# Altium project Triumvi_v10_mcu.PrjPcb
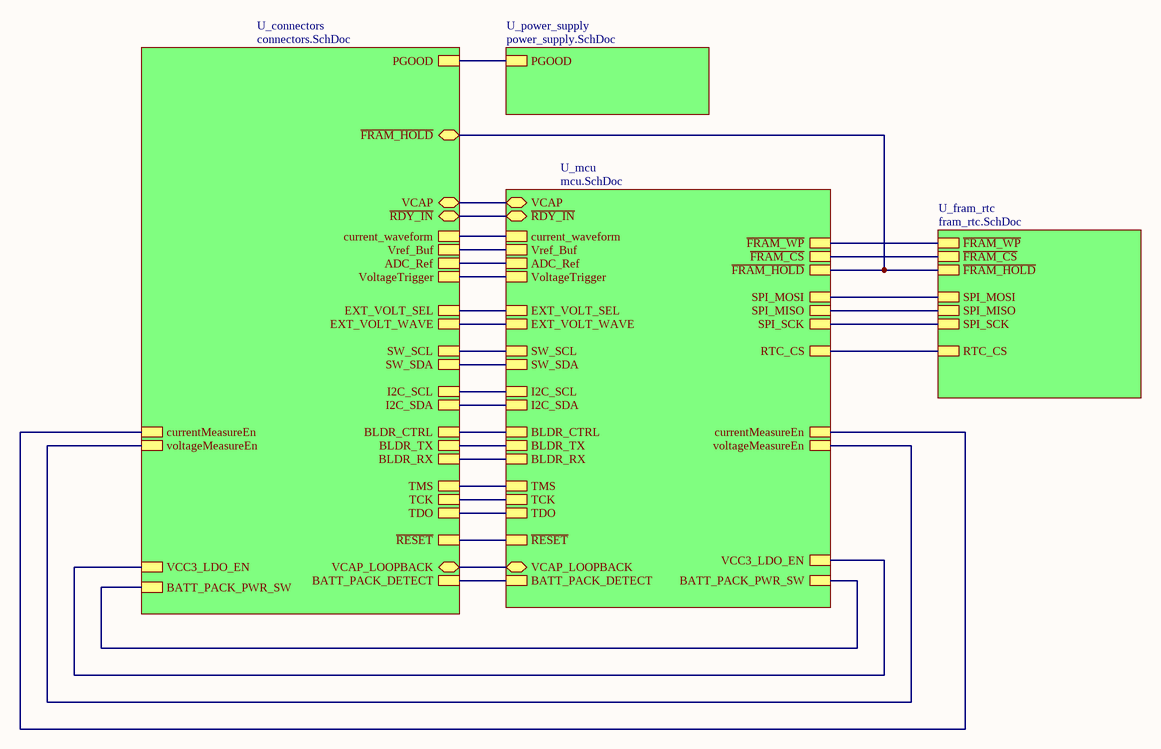
[diagram p0: top.SchDoc]
5 sheets, 66 parts. Net scope: hierarchical (ports join the sheet entries above them; power ports are global).
Board files: triumvi_v10_mcu.PcbDoc, triumvi_v10_mcu_panel.PcbDoc
Sheets:
  top.SchDoc
    U_connectors = connectors.SchDoc
    U_fram_rtc = fram_rtc.SchDoc
    U_mcu = mcu.SchDoc
    U_power_supply = power_supply.SchDoc

## Sheet top.SchDoc: Triumvi - MCU - Top
size Letter; Author: Ye-Sheng Kuo; Organization: Altium Limited; Address1: L3, 12a Rodborough Rd; Address2: Frenchs Forest; Address3: NSW; Address4: Australia 2086; Revision: 10; SheetNumber: 1; SheetTotal: 5

### Sub-sheets
U_connectors = connectors.SchDoc: I2C_SCL, I2C_SDA, EXT_VOLT_SEL, ~{RESET}, TMS, TCK, TDO, BLDR_CTRL, BLDR_TX, BLDR_RX, SW_SCL, SW_SDA, current_waveform, Vref_Buf, VoltageTrigger, VCC3_LDO_EN, voltageMeasureEn, currentMeasureEn, ADC_Ref, EXT_VOLT_WAVE, PGOOD, BATT_PACK_DETECT, BATT_PACK_PWR_SW, VCAP_LOOPBACK, VCAP, ~{RDY_IN}, ~{FRAM_HOLD}
U_fram_rtc = fram_rtc.SchDoc: ~{FRAM_WP}, ~{FRAM_CS}, ~{FRAM_HOLD}, SPI_MOSI, SPI_SCK, SPI_MISO, RTC_CS
U_mcu = mcu.SchDoc: current_waveform, Vref_Buf, voltageMeasureEn, currentMeasureEn, VoltageTrigger, ~{FRAM_WP}, ~{FRAM_CS}, ~{FRAM_HOLD}, SPI_SCK, SPI_MOSI, SPI_MISO, RTC_CS, I2C_SCL, I2C_SDA, EXT_VOLT_SEL, EXT_VOLT_WAVE, TDO, BLDR_CTRL, BLDR_TX, BLDR_RX, ~{RESET}, TMS, TCK, VCC3_LDO_EN, ADC_Ref, SW_SCL, SW_SDA, BATT_PACK_DETECT, BATT_PACK_PWR_SW, VCAP_LOOPBACK, VCAP, ~{RDY_IN}
U_power_supply = power_supply.SchDoc: PGOOD

### Nets
BATT_PACK_DETECT: sheet U_connectors/BATT_PACK_DETECT, sheet U_mcu/BATT_PACK_DETECT
BLD_CTRL: sheet U_connectors/BLDR_CTRL, sheet U_mcu/BLDR_CTRL
BLD_RX: sheet U_connectors/BLDR_RX, sheet U_mcu/BLDR_RX
BLD_TX: sheet U_connectors/BLDR_TX, sheet U_mcu/BLDR_TX
current_waveform: sheet U_connectors/current_waveform, sheet U_mcu/current_waveform
EXT_VOLT_SEL: sheet U_connectors/EXT_VOLT_SEL, sheet U_mcu/EXT_VOLT_SEL
EXT_VOLT_WAVE: sheet U_connectors/EXT_VOLT_WAVE, sheet U_mcu/EXT_VOLT_WAVE
I2C_SCL: sheet U_connectors/I2C_SCL, sheet U_mcu/I2C_SCL
I2C_SDA: sheet U_connectors/I2C_SDA, sheet U_mcu/I2C_SDA
PGOOD: sheet U_connectors/PGOOD, sheet U_power_supply/PGOOD
~{RDY_IN}: sheet U_connectors/~{RDY_IN}, sheet U_mcu/~{RDY_IN}
~{RESET}: sheet U_connectors/~{RESET}, sheet U_mcu/~{RESET}
SPI_CLK: sheet U_fram_rtc/SPI_SCK, sheet U_mcu/SPI_SCK
SPI_MISO: sheet U_fram_rtc/SPI_MISO, sheet U_mcu/SPI_MISO
SPI_MOSI: sheet U_fram_rtc/SPI_MOSI, sheet U_mcu/SPI_MOSI
TCK: sheet U_connectors/TCK, sheet U_mcu/TCK
TDO: sheet U_connectors/TDO, sheet U_mcu/TDO
TMS: sheet U_connectors/TMS, sheet U_mcu/TMS
VCAP: sheet U_connectors/VCAP, sheet U_mcu/VCAP
VCAP_LOOPBACK: sheet U_connectors/VCAP_LOOPBACK, sheet U_mcu/VCAP_LOOPBACK
Vref_Buf: sheet U_connectors/Vref_Buf, sheet U_mcu/Vref_Buf
NetJ1_2: sheet U_connectors/VoltageTrigger, sheet U_mcu/VoltageTrigger
NetJ1_3: sheet U_connectors/SW_SDA, sheet U_mcu/SW_SDA
NetJ1_4: sheet U_connectors/SW_SCL, sheet U_mcu/SW_SCL
NetJ1_8: sheet U_connectors/~{FRAM_HOLD}, sheet U_fram_rtc/~{FRAM_HOLD}, sheet U_mcu/~{FRAM_HOLD}
NetJ1_10: sheet U_connectors/VCC3_LDO_EN, sheet U_mcu/VCC3_LDO_EN
NetJ2_8: sheet U_connectors/voltageMeasureEn, sheet U_mcu/voltageMeasureEn
NetJ2_9: sheet U_connectors/currentMeasureEn, sheet U_mcu/currentMeasureEn
NetJ2_11: sheet U_connectors/ADC_Ref, sheet U_mcu/ADC_Ref
NetQ2_5: sheet U_connectors/BATT_PACK_PWR_SW, sheet U_mcu/BATT_PACK_PWR_SW
NetU1_1: sheet U_fram_rtc/~{FRAM_CS}, sheet U_mcu/~{FRAM_CS}
NetU1_3: sheet U_fram_rtc/~{FRAM_WP}, sheet U_mcu/~{FRAM_WP}
NetU2_30: sheet U_fram_rtc/RTC_CS, sheet U_mcu/RTC_CS

### Notes on the sheet
- Title
- Date:
- Author:
- Revision:
- Sheet
- of
- University of Michigan
- File:

## Sheet connectors.SchDoc: Triumvi - MCU - Connectors
size Letter; Author: Ye-Sheng Kuo; Revision: 10; SheetNumber: 5; SheetTotal: 5
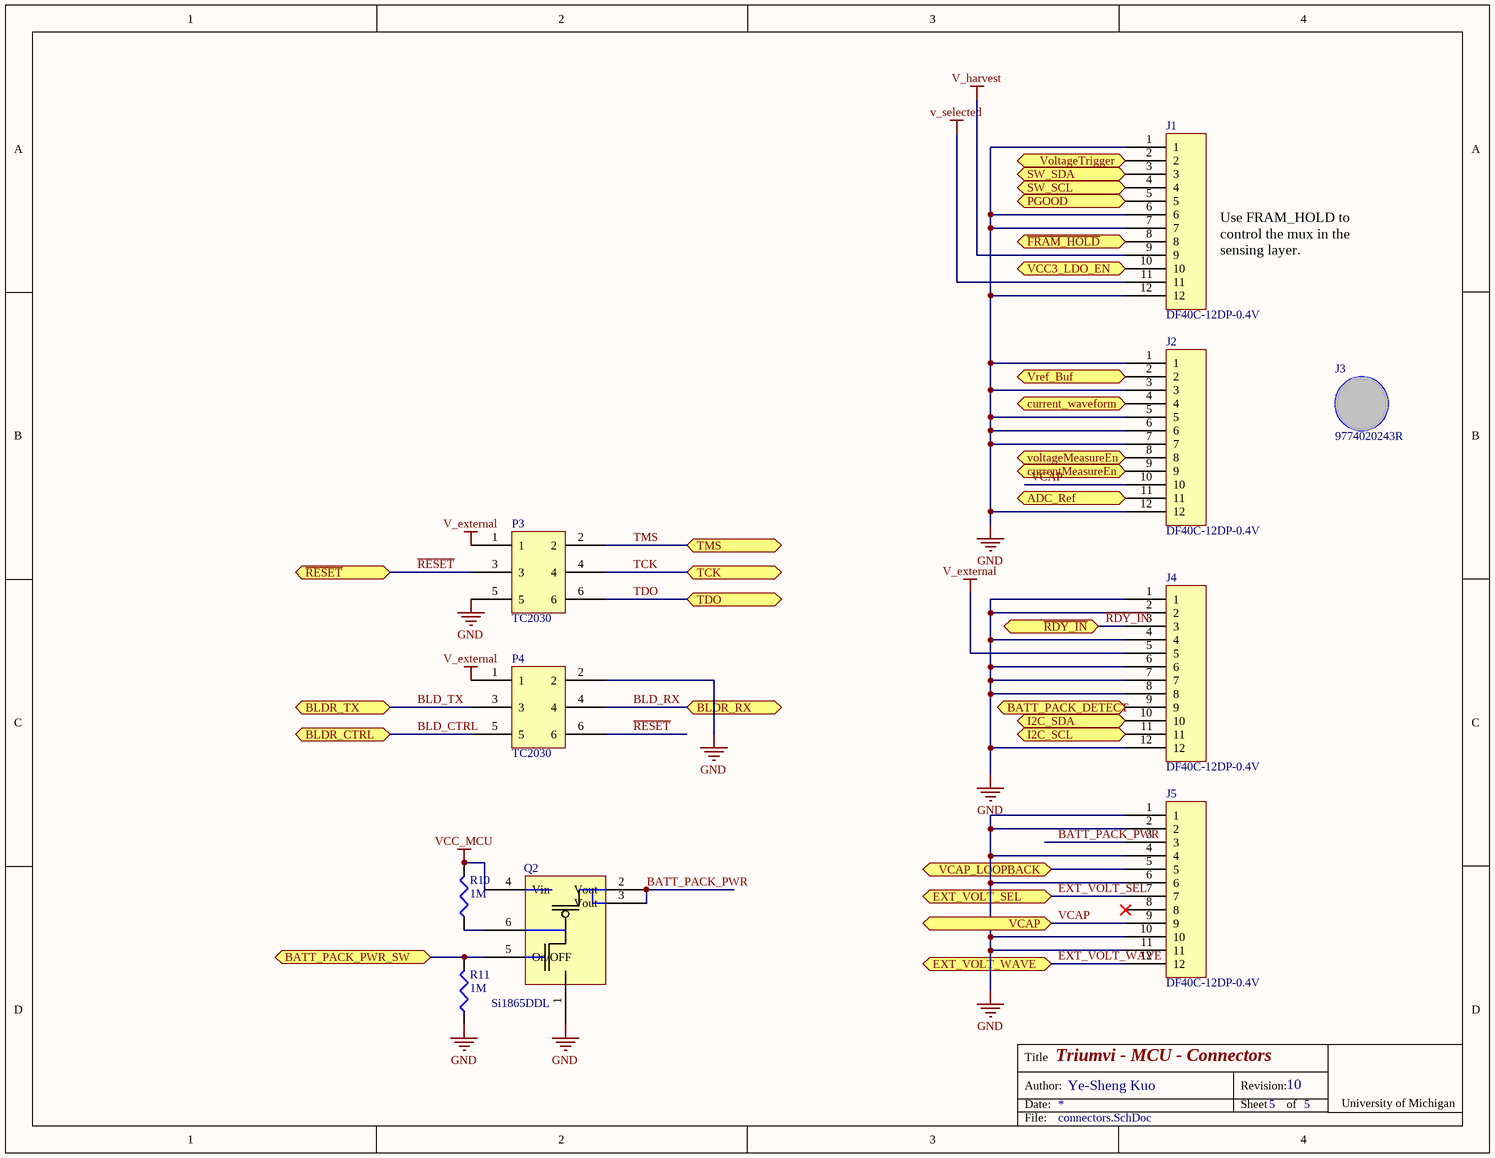
[diagram p1: connectors.SchDoc]

### Parts
J1  DF40C-12DP-0.4V  [DF40C-12DP-0.4V]
J2  DF40C-12DP-0.4V  [DF40C-12DP-0.4V]
J3  9774020243R  [9774020243R]
J4  DF40C-12DP-0.4V  [DF40C-12DP-0.4V]
J5  DF40C-12DP-0.4V  [DF40C-12DP-0.4V]
P3  TC2030  [TC2030-IDC-NLFP]
P4  TC2030  [TC2030-IDC-NLFP]
Q2  Si1865DDL  [SC70-6]
R10  value 1M  [0402]  (hidden comment: Chip resistor)
R11  value 1M  [0402]  (hidden comment: Chip resistor)

### Ports
ADC_Ref, BATT_PACK_DETECT, BATT_PACK_PWR_SW, BLDR_CTRL, BLDR_RX, BLDR_TX, current_waveform, currentMeasureEn, EXT_VOLT_SEL, EXT_VOLT_WAVE, I2C_SCL, I2C_SDA, PGOOD, SW_SCL, SW_SDA, TCK, TDO, TMS, VCAP, VCAP_LOOPBACK, VCC3_LDO_EN, voltageMeasureEn, VoltageTrigger, Vref_Buf, ~{FRAM_HOLD}, ~{RDY_IN}, ~{RESET}

### Nets
GND: J1.1 J1.6 J1.7 J1.12 J2.1 J2.3 J2.5 J2.6 J2.7 J2.12 J4.1 J4.2 J4.4 J4.6 J4.7 J4.8 J4.12 J5.1 J5.2 J5.4 J5.6 J5.10 J5.11 P3.5 P4.2 Q2.1(S1) R11.2
V_external: J4.5 P3.1 P4.1
V_harvest: J1.9
v_selected: J1.11
VCC_MCU: Q2.4(Vin) R10.1
BATT_PACK_DETECT: J4.9 ; port BATT_PACK_DETECT
BATT_PACK_PWR: J5.3 Q2.2(Vout) Q2.3(Vout)
BLD_CTRL: P4.5 ; port BLDR_CTRL
BLD_RX: P4.4 ; port BLDR_RX
BLD_TX: P4.3 ; port BLDR_TX
current_waveform: J2.4 ; port current_waveform
EXT_VOLT_SEL: J5.7 ; port EXT_VOLT_SEL
EXT_VOLT_WAVE: J5.12 ; port EXT_VOLT_WAVE
I2C_SCL: J4.11 ; port I2C_SCL
I2C_SDA: J4.10 ; port I2C_SDA
PGOOD: J1.5 ; port PGOOD
~{RDY_IN}: J4.3 ; port ~{RDY_IN}
~{RESET}: P3.3 P4.6 ; port ~{RESET}
TCK: P3.4 ; port TCK
TDO: P3.6 ; port TDO
TMS: P3.2 ; port TMS
VCAP: J2.10 J5.9 ; port VCAP
VCAP_LOOPBACK: J5.5 ; port VCAP_LOOPBACK
Vref_Buf: J2.2 ; port Vref_Buf
NetJ1_2: J1.2 ; port VoltageTrigger
NetJ1_3: J1.3 ; port SW_SDA
NetJ1_4: J1.4 ; port SW_SCL
NetJ1_8: J1.8 ; port ~{FRAM_HOLD}
NetJ1_10: J1.10 ; port VCC3_LDO_EN
NetJ2_8: J2.8 ; port voltageMeasureEn
NetJ2_9: J2.9 ; port currentMeasureEn
NetJ2_11: J2.11 ; port ADC_Ref
NetQ2_5: Q2.5(On/OFF) R11.1 ; port BATT_PACK_PWR_SW
NetQ2_6: Q2.6(D1) R10.2

Not connected (* = marked no-connect by the designer): J5 8*

### Notes on the sheet
- Use FRAM_HOLD to control the mux in the sensing layer.
- Title
- Date:
- Author:
- Revision:
- Sheet
- of
- University of Michigan
- File:

### Library data of the parts
J1 J2 J4 J5 = DF40C-12DP-0.4V: Hirose BM20 Series, 0.4mm pitch, 12 pos, header; Supplier 1: Digi-Key; Supplier Part Number 1: H124599CT-ND
J3 = 9774020243R: 2 mm stack height, m2 standoff; Supplier 1: Digi-Key; Supplier Part Number 1: 732-7073-1-ND
P3 P4 = TC2030: TC2030-MCP-NL
Q2 = Si1865DDL: Load Switch with Level-Shift; Supplier 1: Digi-Key; Supplier Part Number 1: SI1865DDL-T1-GE3CT-ND
R10 R11 = R_1M_0402: Chip resistor, 1M, 0402 package; tolerance: 1%; power: 1/16 W; Supplier 1: Digi-Key; Supplier Part Number 1: 541-1.00MLCT-ND; package: 0402

## Sheet fram_rtc.SchDoc: Triumvi - MCU - FRAM, RTC
size Letter; Author: Ye-Sheng Kuo; Revision: 10; SheetNumber: 4; SheetTotal: 5
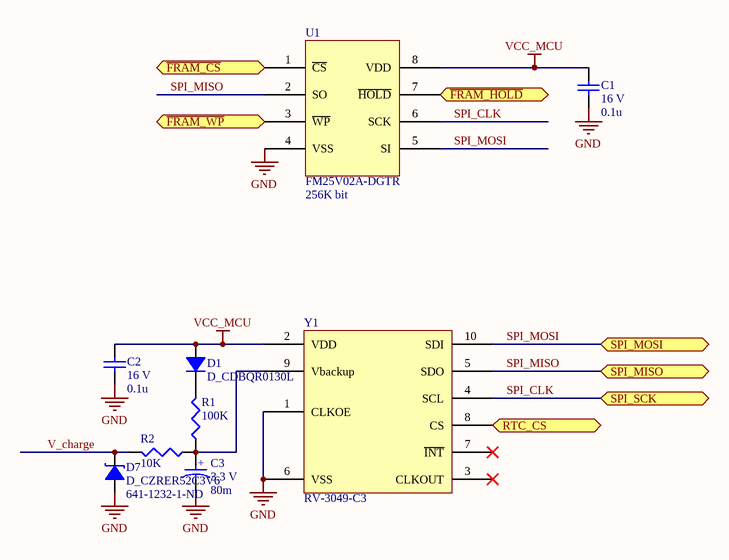
[diagram p2: fram_rtc.SchDoc]

### Parts
C1  value 0.1u  voltage rated: 16 V  [0402]  (hidden comment: Ceramic capacitor)
C2  value 0.1u  voltage rated: 16 V  [0402]  (hidden comment: Ceramic capacitor)
C3  value 80m  voltage rated: 3.3 V  [XH414HG-IV01E]  (hidden comment: Electric Double Layer Capacitors)
D1  D_CDBQR0130L  [0402 - DIODE]
D7  D_CZRER52C3V6  Supplier Part Number 1: 641-1232-1-ND  [0503/SOD-723F]
R1  value 100K  [0402]  (hidden comment: Chip resistor)
R2  value 10K  [0402]  (hidden comment: Chip resistor)
U1  FM25V02A-DGTR  Size: 256K bit  [TDFN-8]
Y1  RV-3049-C3  [RV-3049-C3]

### Ports
RTC_CS, SPI_MISO, SPI_MOSI, SPI_SCK, ~{FRAM_CS}, ~{FRAM_HOLD}, ~{FRAM_WP}

### Nets
GND: C1.2 C2.2 C3.2 D7.1 U1.4(VSS) Y1.1(CLKOE) Y1.6(VSS)
VCC_MCU: C1.1 C2.1 D1.1 U1.8(VDD) Y1.2(VDD)
SPI_CLK: U1.6(SCK) Y1.4(SCL) ; port SPI_SCK
SPI_MISO: U1.2(SO) Y1.5(SDO) ; port SPI_MISO
SPI_MOSI: U1.5(SI) Y1.10(SDI) ; port SPI_MOSI
V_charge: D7.2 R2.1
NetC3_1: C3.1 R1.2 R2.2 Y1.9(Vbackup)
NetD1_2: D1.2 R1.1
NetJ1_8: U1.7(~{HOLD}) ; port ~{FRAM_HOLD}
NetU1_1: U1.1(~{CS}) ; port ~{FRAM_CS}
NetU1_3: U1.3(~{WP}) ; port ~{FRAM_WP}
NetU2_30: Y1.8(CS) ; port RTC_CS

Not connected (* = marked no-connect by the designer): Y1 3(CLKOUT)* 7(~{INT})*

### Notes on the sheet
- Title
- Date:
- Author:
- Revision:
- Sheet
- of
- University of Michigan
- File:
- (in symbol C_80m_3.3V_supercap) +

### Library data of the parts
C1 C2 = C_0.1u_16V_0402_ceramic: Ceramic capacitor, 0.1u, 16 V, 0402 package; Manufacture: Murata; tolerance: 10%; Temperature Coef: X7R; package: 0402; Supplier 1: Digi-Key; Supplier Part Number 1: 490-3261-1-ND
C3 = C_80m_3.3V_supercap: Manufacture: Seiko Instruments; Supplier 1: Digi-Key; Supplier Part Number 1: 728-1050-1-ND
D1 = D_CDBQR0130L: SMD Schottky Barrier Diode; package: 0402; Supplier 1: Digi-Key; Supplier Part Number 1: 641-1271-1-ND
D7 = D_CZRER52C3V6: SURFACE MOUNT ZENER DIODE; package: 0603; Supplier 1: Digi-Key
R1 = R_100K_0402: Chip resistor, 100K, 0402 package; tolerance: 1%; power: 1/16 W; Supplier 1: Digi-Key; Supplier Part Number 1: 541-100KLCT-ND; package: 0402
R2 = R_10K_0402: Chip resistor, 10K, 0402 package; tolerance: 1%; power: 1/16 W; Supplier 1: Digi-Key; Supplier Part Number 1: 541-10.0KLCT-ND; package: 0402
U1 = FM25V02A-DGTR: 256-Kbit (32 K × 8) Serial (SPI) F-RAM; Manufacturer: Cypress Semiconductor; Manufactuere part number: FM25V02A-DGTR; Supplier 1: Digi-Key; Supplier Part Number 1: FM25V02A-DGTR-ND
Y1 = RV-3049-C3: Real Time Clock Module with SPI-Bus

## Sheet mcu.SchDoc: Triumvi - MCU - CC2538
size Letter; Author: Ye-Sheng Kuo; Revision: 10; SheetNumber: 2; SheetTotal: 5
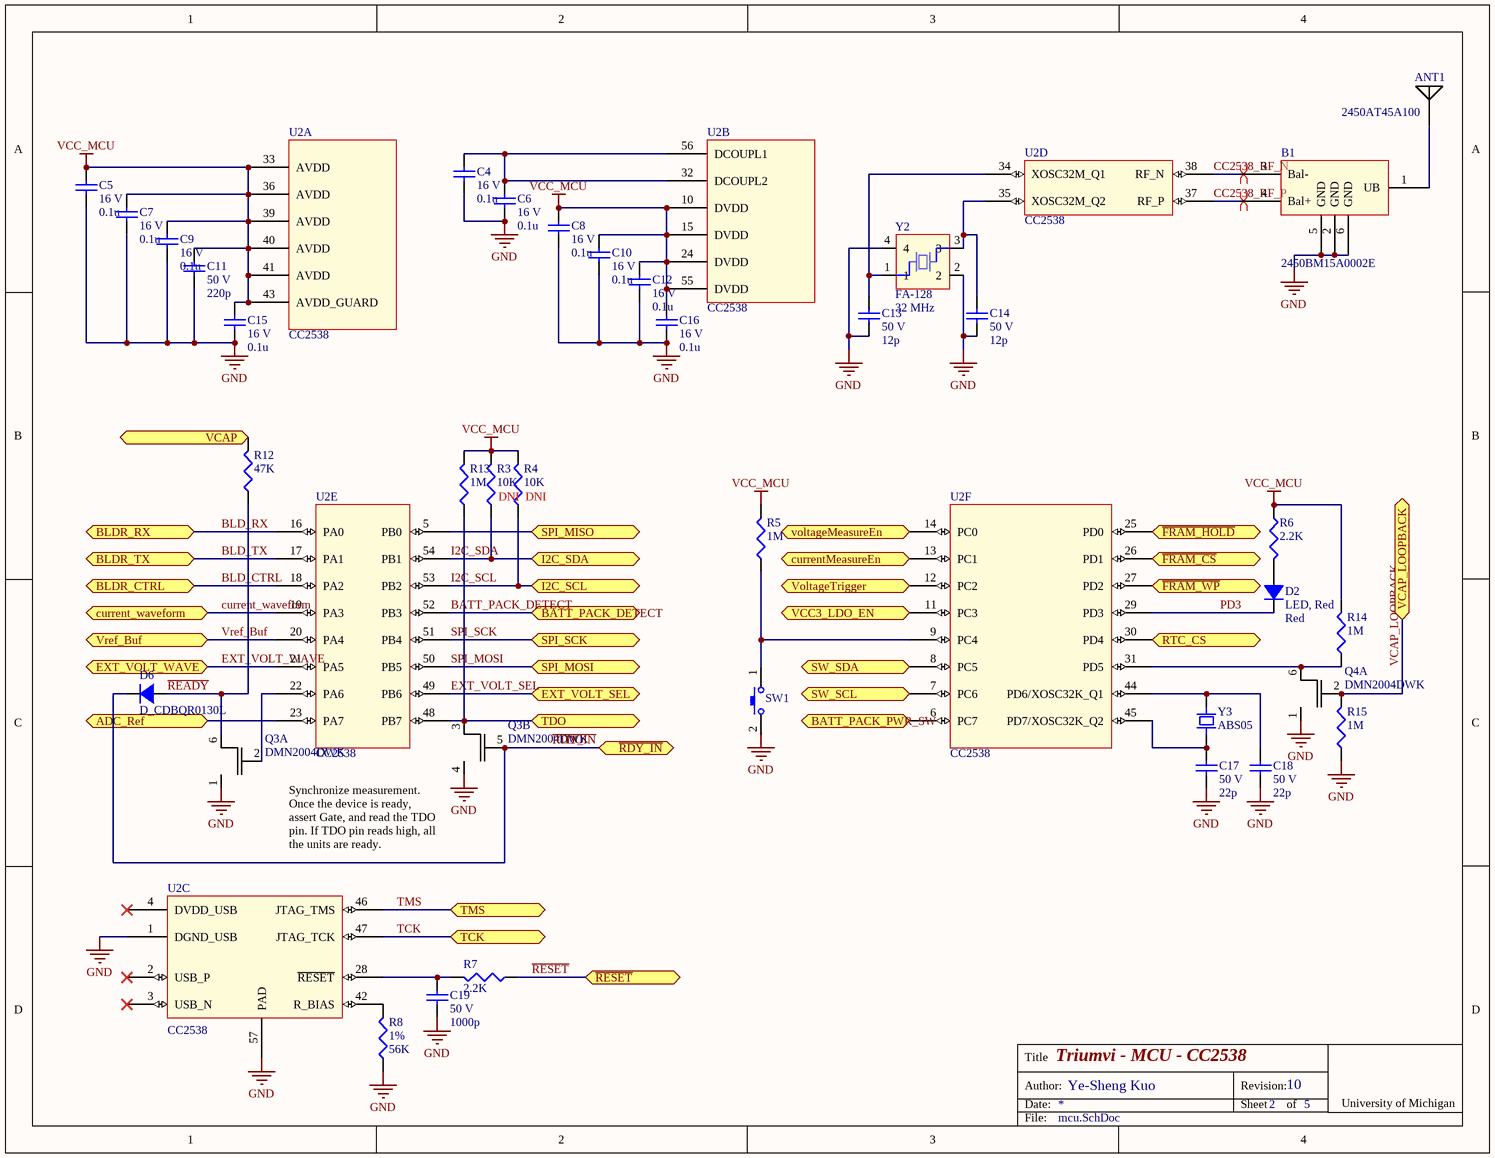
[diagram p3: mcu.SchDoc]

### Parts
ANT1  2450AT45A100  [2450AT45A100]
B1  2450BM15A0002E  [2450BM15A0002]
C4  value 0.1u  voltage rated: 16 V  [0402]  (hidden comment: Ceramic capacitor)
C5  value 0.1u  voltage rated: 16 V  [0402]  (hidden comment: Ceramic capacitor)
C6  value 0.1u  voltage rated: 16 V  [0402]  (hidden comment: Ceramic capacitor)
C7  value 0.1u  voltage rated: 16 V  [0402]  (hidden comment: Ceramic capacitor)
C8  value 0.1u  voltage rated: 16 V  [0402]  (hidden comment: Ceramic capacitor)
C9  value 0.1u  voltage rated: 16 V  [0402]  (hidden comment: Ceramic capacitor)
C10  value 0.1u  voltage rated: 16 V  [0402]  (hidden comment: Ceramic capacitor)
C11  value 220p  voltage rated: 50 V  [0402]  (hidden comment: Ceramic capacitor)
C12  value 0.1u  voltage rated: 16 V  [0402]  (hidden comment: Ceramic capacitor)
C13  value 12p  voltage rated: 50 V  [0402]  (hidden comment: Ceramic capacitor)
C14  value 12p  voltage rated: 50 V  [0402]  (hidden comment: Ceramic capacitor)
C15  value 0.1u  voltage rated: 16 V  [0402]  (hidden comment: Ceramic capacitor)
C16  value 0.1u  voltage rated: 16 V  [0402]  (hidden comment: Ceramic capacitor)
C17  value 22p  voltage rated: 50 V  [0402]  (hidden comment: Ceramic capacitor)
C18  value 22p  voltage rated: 50 V  [0402]  (hidden comment: Ceramic capacitor)
C19  value 1000p  voltage rated: 50 V  [0402]  (hidden comment: Ceramic capacitor)
D2  LED, Red  Color: Red  [0402 - DIODE]
D6  D_CDBQR0130L  [0402 - DIODE]
Q3  DMN2004DWK  [SC70-6]  (parts A,B of 2)
Q4  DMN2004DWK  [SC70-6]  (part A of 2)
R3  value 10K  [0402]  (hidden comment: Chip resistor)
R4  value 10K  [0402]  (hidden comment: Chip resistor)
R5  value 1M  [0402]  (hidden comment: Chip resistor)
R6  value 2.2K  [0402]  (hidden comment: Chip resistor)
R7  value 2.2K  [0402]  (hidden comment: Chip resistor)
R8  value 56K  tolerance: 1%  [0402]  (hidden comment: Chip resistor)
R12  value 47K  [0402]  (hidden comment: Chip resistor)
R13  value 1M  [0402]  (hidden comment: Chip resistor)
R14  value 1M  [0402]  (hidden comment: Chip resistor)
R15  value 1M  [0402]  (hidden comment: Chip resistor)
SW1  EVQP7C  [EVQP7C]  (value not drawn)
U2  CC2538  [QFN56]  (parts A,B,C,D,E,F of 6)
Y2  FA-128  frequency: 32 MHz  [FA-128]
Y3  ABS05  [ABS05]

### Ports
ADC_Ref, BATT_PACK_DETECT, BATT_PACK_PWR_SW, BLDR_CTRL, BLDR_RX, BLDR_TX, current_waveform, currentMeasureEn, EXT_VOLT_SEL, EXT_VOLT_WAVE, I2C_SCL, I2C_SDA, RTC_CS, SPI_MISO, SPI_MOSI, SPI_SCK, SW_SCL, SW_SDA, TCK, TDO, TMS, VCAP, VCAP_LOOPBACK, VCC3_LDO_EN, voltageMeasureEn, VoltageTrigger, Vref_Buf, ~{FRAM_CS}, ~{FRAM_HOLD}, ~{FRAM_WP}, ~{RDY_IN}, ~{RESET}

### Nets
GND: B1.2(GND) B1.5(GND) B1.6(GND) C4.2 C5.2 C6.2 C7.2 C8.2 C9.2 C10.2 C11.2 C12.2 C13.1 C14.1 C15.2 C16.2 C17.2 C18.2 C19.2 Q3.1(S2) Q3.4(S1) Q4.1(S2) R8.2 R15.2 SW1.2 U2.1(DGND_USB) U2.57(PAD) Y2.2 Y2.4
VCC_MCU: C5.1 C7.1 C8.1 C9.1 C10.1 C11.1 C12.1 C15.1 C16.1 R3.1 R4.1 R5.1 R6.2 R13.1 R14.1 U2.10(DVDD) U2.15(DVDD) U2.24(DVDD) U2.33(AVDD) U2.36(AVDD) U2.39(AVDD) U2.40(AVDD) U2.41(AVDD) U2.43(AVDD_GUARD) U2.55(DVDD)
BATT_PACK_DETECT: U2.52(PB3) ; port BATT_PACK_DETECT
BLD_CTRL: U2.18(PA2) ; port BLDR_CTRL
BLD_RX: U2.16(PA0) ; port BLDR_RX
BLD_TX: U2.17(PA1) ; port BLDR_TX
CC2538_RF_N: B1.3(Bal-) U2.38(RF_N)
CC2538_RF_P: B1.4(Bal+) U2.37(RF_P)
current_waveform: U2.19(PA3) ; port current_waveform
EXT_VOLT_SEL: U2.49(PB6) ; port EXT_VOLT_SEL
EXT_VOLT_WAVE: U2.21(PA5) ; port EXT_VOLT_WAVE
I2C_SCL: R4.2 U2.53(PB2) ; port I2C_SCL
I2C_SDA: R3.2 U2.54(PB1) ; port I2C_SDA
PD3: D2.2 U2.29(PD3)
~{RDY_IN}: D6.2 Q3.5(G1) ; port ~{RDY_IN}  [also labelled TDO]
~{READY}: D6.1 Q3.6(D2) R12.2
~{RESET}: R7.2 ; port ~{RESET}
SPI_MISO: U2.5(PB0) ; port SPI_MISO
SPI_MOSI: U2.50(PB5) ; port SPI_MOSI
SPI_SCK: U2.51(PB4) ; port SPI_SCK  [project net SPI_CLK]
TCK: U2.47(JTAG_TCK) ; port TCK
TDO: Q3.3(D1) R13.2 U2.48(PB7) ; port TDO
TMS: U2.46(JTAG_TMS) ; port TMS
VCAP: R12.1 ; port VCAP
VCAP_LOOPBACK: Q4.2(G2) R15.1 ; port VCAP_LOOPBACK
Vref_Buf: U2.20(PA4) ; port Vref_Buf
NetANT1_1: ANT1.1 B1.1(UB)
NetC4_1: C4.1 C6.1 U2.32(DCOUPL2) U2.56(DCOUPL1)
NetC13_2: C13.2 U2.34(XOSC32M_Q1) Y2.1
NetC14_2: C14.2 U2.35(XOSC32M_Q2) Y2.3
NetC17_1: C17.1 U2.45(PD7/XOSC32K_Q2) Y3.2
NetC18_1: C18.1 U2.44(PD6/XOSC32K_Q1) Y3.1
NetC19_1: C19.1 R7.1 U2.28(~{RESET})
NetD2_1: D2.1 R6.1
NetJ1_2: U2.12(PC2) ; port VoltageTrigger
NetJ1_3: U2.8(PC5) ; port SW_SDA
NetJ1_4: U2.7(PC6) ; port SW_SCL
NetJ1_8: U2.25(PD0) ; port ~{FRAM_HOLD}
NetJ1_10: U2.11(PC3) ; port VCC3_LDO_EN
NetJ2_8: U2.14(PC0) ; port voltageMeasureEn
NetJ2_9: U2.13(PC1) ; port currentMeasureEn
NetJ2_11: U2.23(PA7) ; port ADC_Ref
NetQ2_5: U2.6(PC7) ; port BATT_PACK_PWR_SW
NetQ3_2: Q3.2(G2) U2.22(PA6)
NetQ4_6: Q4.6(D2) R14.2 U2.31(PD5)
NetR5_2: R5.2 SW1.1 U2.9(PC4)
NetR8_1: R8.1 U2.42(R_BIAS)
NetU1_1: U2.26(PD1) ; port ~{FRAM_CS}
NetU1_3: U2.27(PD2) ; port ~{FRAM_WP}
NetU2_30: U2.30(PD4) ; port RTC_CS

Not connected (* = marked no-connect by the designer): U2 2(USB_P)* 3(USB_N)* 4(DVDD_USB)*

### Layout directives
differential pair: CC2538_RF_N, CC2538_RF_P

### Notes on the sheet
- DNI
- (near R4) DNI
- (near Q3) Synchronize measurement. Once the device is ready, assert Gate, and read the TDO pin. If TDO pin reads high, all the units are ready.
- Title
- Date:
- Author:
- Revision:
- Sheet
- of
- University of Michigan
- File:

### Library data of the parts
ANT1 = 2450AT45A100: 2.45 GHz High Gain SMD Chip Antenna; Supplier 1: Digi-Key; Supplier Part Number 1: 712-1012-1-ND
B1 = 2450BM15A0002E: 2.45 GHz Balun for TI CC253X; Supplier 1: Digi-Key; Supplier Part Number 1: 712-1536-1-ND
C4-C10 C12 C15 C16 = C_0.1u_16V_0402_ceramic: as C1 on sheet fram_rtc; package: 0402; Supplier 1: Digi-Key; Supplier Part Number 1: 490-3261-1-ND
C11 = C_220p_50V_0402_ceramic: Ceramic capacitor, 220 pF, 0402 package; Manufacture: Johanson; tolerance: 10%; package: 0402; Temperature: X7R; Supplier 1: Digi-Key; Supplier Part Number 1: 445-1254-1-ND
C13 C14 = C_12p_0402_ceramic: Ceramic capacitor, 12 pF, 0402 package; Manufacture: Johanson; tolerance: 2%; package: 0402; Supplier 1: Digi-Key; Supplier Part Number 1: 712-1256-1-ND
C17 C18 = C_22p_0402_ceramic: Ceramic capacitor, 22 pF, 0402 package; Manufacture: Johanson; tolerance: 2%; package: 0402; Supplier 1: Digi-Key; Supplier Part Number 1: 712-1274-1-ND
C19 = C_1000p_50V_0402_ceramic: Ceramic capacitor, 1000 pF, 0402 package; Manufacture: TDK; tolerance: 10%; package: 0402; Supplier 1: Digi-Key; Supplier Part Number 1: 445-6846-1-ND
D2 = D_LED_RED_0402: LED, Red, 0402; package: 0402; Supplier 1: Digi-Key; Supplier Part Number 1: 511-1593-1-ND
D6 = D_CDBQR0130L: SMD Schottky Barrier Diode; package: 0402; Supplier 1: Digi-Key; Supplier Part Number 1: 641-1271-1-ND
Q3 Q4 = DMN2004DWK: DUAL N-CHANNEL ENHANCEMENT MODE MOSFET; Supplier 1: Digi-Key; Supplier Part Number 1: DMN2004DWKDICT-ND
R3 R4 = R_10K_0402: as R2 on sheet fram_rtc; Supplier 1: Digi-Key; Supplier Part Number 1: 541-10.0KLCT-ND; package: 0402
R5 R13-R15 = R_1M_0402: as R10 on sheet connectors; Supplier 1: Digi-Key; Supplier Part Number 1: 541-1.00MLCT-ND; package: 0402
R6 R7 = R_2.2K_0402: Chip resistor, 2.2K, 0402 package; tolerance: 1%; power: 1/16 W; package: 0402; Supplier 1: Digi-Key; Supplier Part Number 1: 541-2.20KLCT-ND
R8 = R_56K_0402_1%: Chip resistor, 56K, 0402 package; power: 1/16 W; Temperature coefficient: 100 ppm/C; package: 0402; Supplier 1: Digi-Key; Supplier Part Number 1: 541-56.0KLCT-ND
R12 = R_47K_0402: Chip resistor, 47K, 0402 package; tolerance: 1%; power: 1/16 W; package: 0402; Supplier 1: Digi-Key; Supplier Part Number 1: 541-47.0KLCT-ND
SW1 = EVQP7C: 3.5 mm×2.9 mm Side-operational SMD  Light Touch Switches; Supplier 1: Digi-Key; Supplier Part Number 1: P16769CT-ND
U2 = CC2538: A Powerful System-On-Chip for 2.4-GHz IEEE 802.15.4, 6LoWPAN  and ZigBee Applications; Supplier 1: Digi-Key; Supplier Part Number 1: 296-35797-1-ND
Y2 = FA-128: MHz Range Crystal Unit; Load capatance: 10 pF; ESR: 60; stability: 20 ppm; Supplier 1: Digi-Key; Supplier Part Number 1: SER3800CT-ND
Y3 = ABS05: 32768 Hz SMD Low profile crystal; Supplier 1: Digi-Key; Supplier Part Number 1: 535-11899-1-ND

## Sheet power_supply.SchDoc: Triumvi - MCU - Power supply
size Letter; Author: Ye-Sheng Kuo; Revision: 10; SheetNumber: 3; SheetTotal: 5
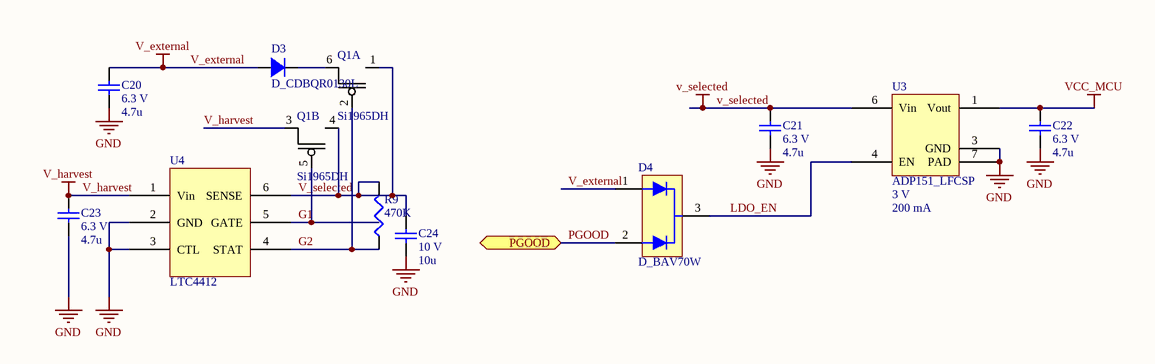
[diagram p4: power_supply.SchDoc]

### Parts
C20  value 4.7u  voltage rated: 6.3 V  [0402]  (hidden comment: Ceramic capacitor)
C21  value 4.7u  voltage rated: 6.3 V  [0402]  (hidden comment: Ceramic capacitor)
C22  value 4.7u  voltage rated: 6.3 V  [0402]  (hidden comment: Ceramic capacitor)
C23  value 4.7u  voltage rated: 6.3 V  [0402]  (hidden comment: Ceramic capacitor)
C24  value 10u  voltage rated: 10 V  [0603]  (hidden comment: Ceramic capacitor)
D3  D_CDBQR0130L  [0402 - DIODE]
D4  D_BAV70W  [SOT323]
Q1  Si1965DH  [SC70-6]  (parts A,B of 2)
R9  value 470K  [0402]  (hidden comment: Chip resistor)
U3  ADP151_LFCSP  Voltage: 3 V  Current: 200 mA  [CP-6-3]
U4  LTC4412  [TSOT-23]

### Ports
PGOOD

### Nets
GND: C20.2 C21.2 C22.2 C23.2 C24.2 U3.3(GND) U3.7(PAD) U4.2(GND) U4.3(CTL)
V_external: C20.1 D3.1 D4.1
V_harvest: C23.1 Q1.3(D2) U4.1(Vin)
v_selected: C21.1 C24.1 Q1.1(S1) Q1.4(S2) R9.1 U3.6(Vin) U4.6(SENSE)
VCC_MCU: C22.1 U3.1(Vout)
G1: Q1.5(G2) U4.5(GATE)
G2: Q1.2(G1) R9.2 U4.4(STAT)
LDO_EN: D4.3 U3.4(EN)
PGOOD: D4.2 ; port PGOOD
NetD3_2: D3.2 Q1.6(D1)

### Notes on the sheet
- Title
- Date:
- Author:
- Revision:
- Sheet
- of
- University of Michigan
- File:

### Library data of the parts
C20-C23 = C_4.7u_6.3V_0402_ceramic: Ceramic capacitor, 4.7 uF, 6.3V, 0402 package; Manufacture: Murata; tolerance: 20%; Temperature rating: X5R; package: 0402; Supplier 1: Digi-Key; Supplier Part Number 1: 490-5915-1-ND
C24 = C_10u_10V_0603_ceramic: Ceramic capacitor, 10 uF, 10 V, 0603 package; Manufacture: Murata; tolerance: 20%; Temperature Coefficient: X5R; package: 0603; Supplier 1: Digi-Key; Supplier Part Number 1: 490-7197-1-ND
D3 = D_CDBQR0130L: SMD Schottky Barrier Diode; package: 0402; Supplier 1: Digi-Key; Supplier Part Number 1: 641-1271-1-ND
D4 = D_BAV70W: DUAL SURFACE MOUNT SWITCHING DIODE; Supplier 1: Digi-Key; Supplier Part Number 1: BAV70W-FDICT-ND
Q1 = Si1965DH: Dual P-Channel 12 V (D-S) MOSFET; Supplier 1: Digi-Key; Supplier Part Number 1: SI1965DH-T1-GE3CT-ND
R9 = R_470K_0402: Chip resistor, 470K, 0402 package; tolerance: 5%; power: 1/16 W; package: 0402; Supplier 1: Digi-Key; Supplier Part Number 1: 541-470KJCT-ND
U3 = ADP151_LFCSP: Ultralow Noise, 200 mA,  CMOS Linear Regulator; Supplier 1: Digi-Key; Supplier Part Number 1: ADP151ACPZ-3.0-R7CT-ND
U4 = LTC4412: Low Loss PowerPath Controller in ThinSOT; Supplier 1: Digi-Key; Supplier Part Number 1: LTC4412ES6#TRMPBFCT-ND

## Nets that join several sheets
GND: connectors (27 pins), fram_rtc (7 pins), mcu (29 pins), power_supply (9 pins)
V_external: connectors (J4.5 P3.1 P4.1), power_supply (C20.1 D3.1 D4.1)
V_harvest: connectors (J1.9), power_supply (C23.1 Q1.3 U4.1)
v_selected: connectors (J1.11), power_supply (7 pins)
VCC_MCU: connectors (Q2.4 R10.1), fram_rtc (5 pins), mcu (25 pins), power_supply (C22.1 U3.1)
BATT_PACK_DETECT: connectors (J4.9), mcu (U2.52)
BLD_CTRL: connectors (P4.5), mcu (U2.18)
BLD_RX: connectors (P4.4), mcu (U2.16)
BLD_TX: connectors (P4.3), mcu (U2.17)
current_waveform: connectors (J2.4), mcu (U2.19)
EXT_VOLT_SEL: connectors (J5.7), mcu (U2.49)
EXT_VOLT_WAVE: connectors (J5.12), mcu (U2.21)
I2C_SCL: connectors (J4.11), mcu (R4.2 U2.53)
I2C_SDA: connectors (J4.10), mcu (R3.2 U2.54)
NetJ1_2: connectors (J1.2), mcu (U2.12)
NetJ1_3: connectors (J1.3), mcu (U2.8)
NetJ1_4: connectors (J1.4), mcu (U2.7)
NetJ1_8: connectors (J1.8), fram_rtc (U1.7), mcu (U2.25)
NetJ1_10: connectors (J1.10), mcu (U2.11)
NetJ2_8: connectors (J2.8), mcu (U2.14)
NetJ2_9: connectors (J2.9), mcu (U2.13)
NetJ2_11: connectors (J2.11), mcu (U2.23)
NetQ2_5: connectors (Q2.5 R11.1), mcu (U2.6)
NetU1_1: fram_rtc (U1.1), mcu (U2.26)
NetU1_3: fram_rtc (U1.3), mcu (U2.27)
NetU2_30: fram_rtc (Y1.8), mcu (U2.30)
PGOOD: connectors (J1.5), power_supply (D4.2)
~{RDY_IN}: connectors (J4.3), mcu (D6.2 Q3.5)
~{RESET}: connectors (P3.3 P4.6), mcu (R7.2)
SPI_CLK: fram_rtc (U1.6 Y1.4), mcu (U2.51)
SPI_MISO: fram_rtc (U1.2 Y1.5), mcu (U2.5)
SPI_MOSI: fram_rtc (U1.5 Y1.10), mcu (U2.50)
TCK: connectors (P3.4), mcu (U2.47)
TDO: connectors (P3.6), mcu (Q3.3 R13.2 U2.48)
TMS: connectors (P3.2), mcu (U2.46)
VCAP: connectors (J2.10 J5.9), mcu (R12.1)
VCAP_LOOPBACK: connectors (J5.5), mcu (Q4.2 R15.1)
Vref_Buf: connectors (J2.2), mcu (U2.20)